# Altium schematic sheet LVDS.SchDoc
size A4
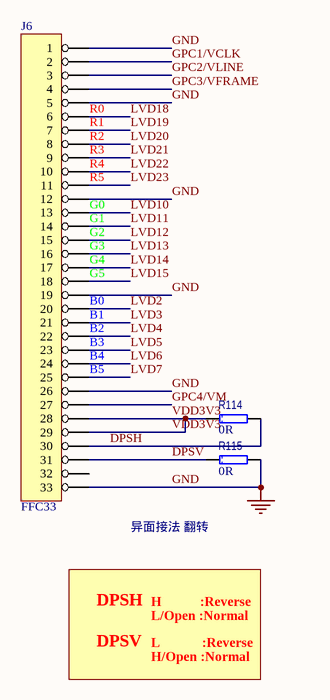
[diagram p0: LVDS.SchDoc]

## Parts
J6  FFC33  [FFC/SM0.5-2H33]
R114  0R  [1608[0603]R]
R115  0R  [1608[0603]R]

## Nets
GND: J6.1 J6.5 J6.12 J6.19 J6.26 J6.33 R115.2
DPSH: J6.30 R114.2
DPSV: J6.31 R115.1
GPC1/VCLK: J6.2
GPC2/VLINE: J6.3
GPC3/VFRAME: J6.4
GPC4/VM: J6.27
LVD2: J6.20
LVD3: J6.21
LVD4: J6.22
LVD5: J6.23
LVD6: J6.24
LVD7: J6.25
LVD10: J6.13
LVD11: J6.14
LVD12: J6.15
LVD13: J6.16
LVD14: J6.17
LVD15: J6.18
LVD18: J6.6
LVD19: J6.7
LVD20: J6.8
LVD21: J6.9
LVD22: J6.10
LVD23: J6.11
VDD3V3: J6.28 J6.29 R114.1

Not connected (* = marked no-connect by the designer): J6 32

## Notes on the sheet
- (near J6) R0
- (near J6) R1
- (near J6) R2
- (near J6) R3
- (near J6) R4
- (near J6) R5
- (near J6) G0
- (near J6) G1
- (near J6) G2
- (near J6) G3
- (near J6) G4
- (near J6) G5
- (near J6) B0
- (near J6) B1
- (near J6) B2
- (near J6) B3
- (near J6) B4
- (near J6) B5
- (near J6) 异面接法 翻转
- DPSH
- DPSV
- H           :Reverse
- L/Open :Normal
- L            :Reverse
- H/Open :Normal

## Library data of the parts
J6 = HEADER 33: CON
R114 R115 = RES: Manufacturer: vishay; Model: RT0603DRD7D0RL; Value: 0R; Type: 无铅电阻